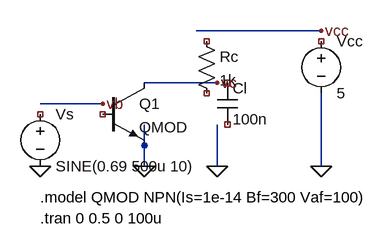
[diagram p0: schematic ce_nominal_tran.asc]
ce_nominal_tran.asc, the LTspice schematic file:
Version 4
SHEET 1 880 680
WIRE 48 160 144 160
WIRE 208 128 288 128
WIRE 288 128 320 128
WIRE 288 48 480 48
WIRE 208 192 208 256
WIRE 320 192 320 256
WIRE 480 144 480 256
FLAG 48 256 0
FLAG 208 256 0
FLAG 320 256 0
FLAG 480 256 0
FLAG 144 160 vb
FLAG 320 128 vc
FLAG 480 48 vcc
SYMBOL voltage 48 160 R0
WINDOW 123 24 124 Left 2
WINDOW 39 0 0 Left 2
SYMATTR InstName Vs
SYMATTR Value SINE(0.69 500u 10)
SYMBOL npn 144 128 R0
SYMATTR InstName Q1
SYMATTR Value QMOD
SYMBOL res 288 48 R0
SYMATTR InstName Rc
SYMATTR Value 1k
SYMBOL cap 320 128 R0
SYMATTR InstName Cl
SYMATTR Value 100n
SYMBOL voltage 480 48 R0
SYMATTR InstName Vcc
SYMATTR Value 5
TEXT 48 304 Left 2 !.model QMOD NPN(Is=1e-14 Bf=300 Vaf=100)
TEXT 48 336 Left 2 !.tran 0 0.5 0 100u

The netlist it stands for:
* ce_nominal_tran.asc
Vs NC_01 0 SINE(0.69 500u 10)
* Q1: QMOD (symbol npn not certain, pin order unknown); nets seen at it: 0, vc
Rc NC_03 NC_04 1k
Cl NC_05 NC_06 100n
Vcc NC_07 0 5
.model QMOD NPN(Is=1e-14 Bf=300 Vaf=100)
.tran 0 0.5 0 100u
.backanno
.end